# Altium schematic sheet LCD-24.SchDoc: LCD 2.4"
size A4; Date: Not used; ApprovedBy: Not used; CheckedBy: Not used; Author: Not used; CompanyName: STMicroelectronics; DrawnBy: Not used; Engineer: Not used; Organization: Not used; Address1: Not used; Address2: Not used; Address3: Not used; Address4: Not used; Revision: Not used; SheetNumber: 6; SheetTotal: 8; CurrentTime: Not used; CurrentDate: Not used; Time: Not used; DocumentFullPathAndName: Not used; DocumentName: Not used; ModifiedDate: Not used; ImagePath: Not used; ProjectName: Not used; Application_BuildNumber: Not used
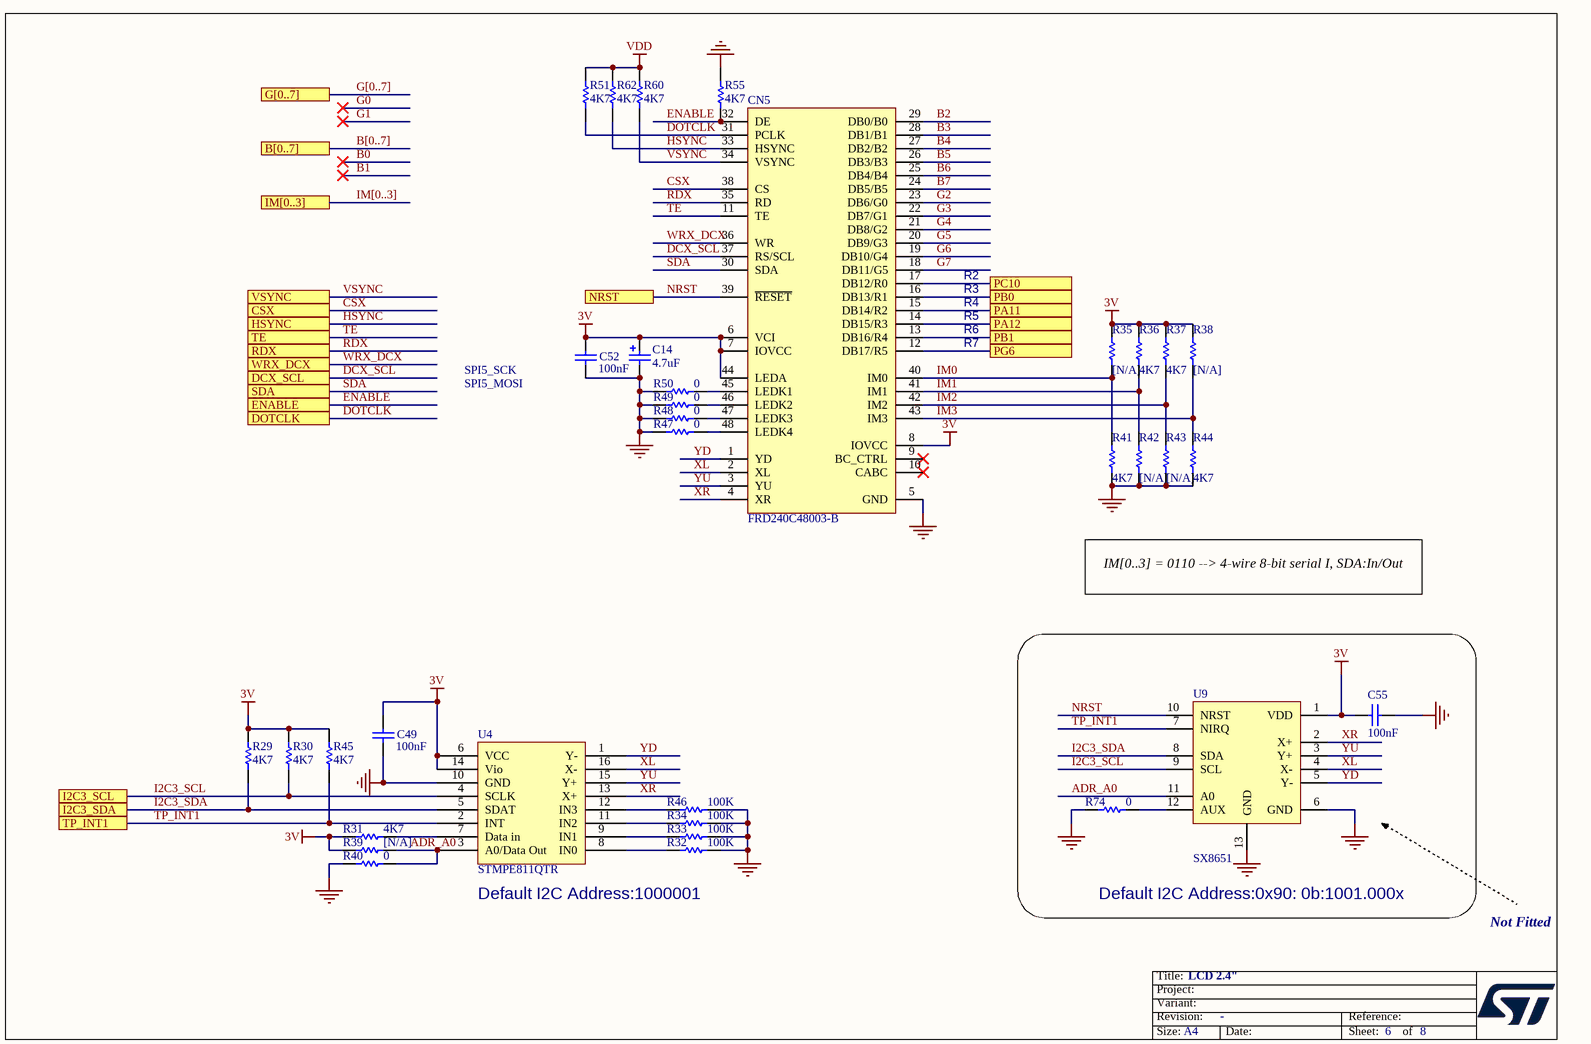
[diagram p0: LCD-24.SchDoc]

## Parts
C14  4.7uF  [TAN-A]
C49  100nF  [0402C]
C52  100nF  [0402C]
C55  100nF  [0402C]
CN5  FRD240C48003-B  [LCD_FRIDA_FRD240C48003-B]
R29  4K7  [0402R]
R30  4K7  [0402R]
R31  4K7  [0402R]
R32  100K  [0402R]
R33  100K  [0402R]
R34  100K  [0402R]
R35  [N/A]  [0402R]
R36  4K7  [0402R]
R37  4K7  [0402R]
R38  [N/A]  [0402R]
R39  [N/A]  [0402R]
R40  0  [0402R]
R41  4K7  [0402R]
R42  [N/A]  [0402R]
R43  [N/A]  [0402R]
R44  4K7  [0402R]
R45  4K7  [0402R]
R46  100K  [0402R]
R47  0  [0603R]
R48  0  [0603R]
R49  0  [0603R]
R50  0  [0603R]
R51  4K7  [0402R]
R55  4K7  [0402R]
R60  4K7  [0402R]
R62  4K7  [0402R]
R74  0  [0402R]
U4  STMPE811QTR  [QFN16_3X3]
U9  SX8651  [ICC_DFN12-EPAD_3X3_P045]

## Blocks framed on the sheet
Default I2C Address:0x90: 0b:1001.000x: C55 R74 U9

## Ports
B[0..7], CSX, DCX_SCL, DOTCLK, ENABLE, G[0..7], HSYNC, I2C3_SCL, I2C3_SDA, IM[0..3], NRST, PA11, PA12, PB0, PB1, PC10, PG6, RDX, SDA, TE, TP_INT1, VSYNC, WRX_DCX

## Nets
3V: C14.1 C49.2 C52.2 C55.1 CN5.6(VCI) CN5.7(IOVCC) CN5.8(IOVCC) CN5.44(LEDA) R29.2 R30.2 R31.1 R35.2 R36.2 R37.2 R38.2 R39.1 R45.2 U4.6(VCC) U4.14(Vio) U9.1(VDD)
GND: C14.2 C49.1 C52.1 C55.2 CN5.5(GND) R32.2 R33.2 R34.2 R40.1 R41.1 R42.1 R43.1 R44.1 R46.2 R47.1 R48.1 R49.1 R50.1 R55.2 R74.1 U4.10(GND) U9.6(GND) U9.13(GND)
VDD: R51.2 R60.2 R62.2
ADR_A0: R39.2 R40.2 U4.3(A0/Data_Out) U9.11(A0)
B2: CN5.29(DB0/B0)
B3: CN5.28(DB1/B1)
B4: CN5.27(DB2/B2)
B5: CN5.26(DB3/B3)
B6: CN5.25(DB4/B4)
B7: CN5.24(DB5/B5)
CSX: CN5.38(CS) ; port CSX
DCX_SCL: CN5.37(RS/SCL) ; port DCX_SCL
DOTCLK: CN5.31(PCLK) R51.1 ; port DOTCLK
ENABLE: CN5.32(DE) R55.1 ; port ENABLE
G2: CN5.23(DB6/G0)
G3: CN5.22(DB7/G1)
G4: CN5.21(DB8/G2)
G5: CN5.20(DB9/G3)
G6: CN5.19(DB10/G4)
G7: CN5.18(DB11/G5)
HSYNC: CN5.33(HSYNC) R62.1 ; port HSYNC
I2C3_SCL: R30.1 U4.4(SCLK) U9.9(SCL) ; port I2C3_SCL
I2C3_SDA: R29.1 U4.5(SDAT) U9.8(SDA) ; port I2C3_SDA
IM0: CN5.40(IM0) R35.1 R41.2
IM1: CN5.41(IM1) R36.1 R42.2
IM2: CN5.42(IM2) R37.1 R43.2
IM3: CN5.43(IM3) R38.1 R44.2
NRST: CN5.39(~{RESET}) U9.10(NRST) ; port NRST
PA11: CN5.15(DB14/R2) ; port PA11
PA12: CN5.14(DB15/R3) ; port PA12
PB0: CN5.16(DB13/R1) ; port PB0
PB1: CN5.13(DB16/R4) ; port PB1
PC10: CN5.17(DB12/R0) ; port PC10
PG6: CN5.12(DB17/R5) ; port PG6
RDX: CN5.35(RD) ; port RDX
SDA: CN5.30(SDA) ; port SDA
TE: CN5.11(TE) ; port TE
TP_INT1: R45.1 U4.2(INT) U9.7(NIRQ) ; port TP_INT1
VSYNC: CN5.34(VSYNC) R60.1 ; port VSYNC
WRX_DCX: CN5.36(WR) ; port WRX_DCX
XL: CN5.2(XL) U4.16(X-) U9.4(X-)
XR: CN5.4(XR) U4.13(X+) U9.2(X+)
YD: CN5.1(YD) U4.1(Y-) U9.5(Y-)
YU: CN5.3(YU) U4.15(Y+) U9.3(Y+)
NetCN5_45: CN5.45(LEDK1) R50.2
NetCN5_46: CN5.46(LEDK2) R49.2
NetCN5_47: CN5.47(LEDK3) R48.2
NetCN5_48: CN5.48(LEDK4) R47.2
NetR31_2: R31.2 U4.7(Data_in)
NetR32_1: R32.1 U4.8(IN0)
NetR33_1: R33.1 U4.9(IN1)
NetR34_1: R34.1 U4.11(IN2)
NetR46_1: R46.1 U4.12(IN3)
NetR74_2: R74.2 U9.12(AUX)

Not connected (* = marked no-connect by the designer): CN5 9(BC_CTRL)* 10(CABC)*

## Buses and harness runs
bus B[0..7] = port B[0..7]
bus G[0..7] = port G[0..7]
bus IM[0..3] = port IM[0..3]

## Notes on the sheet
- R4
- R5
- R3
- R2
- SPI5_MOSI
- SPI5_SCK
- R6
- R7
- IM[0..3] = 0110 --> 4-wire 8-bit serial I, SDA:In/Out
- Default I2C Address:1000001
- Not Fitted
- Title:
- Project:
- Size:
- Revision:
- Variant:
- A4
- -
- Date:
- Reference:
- Sheet:
- of

## Library data of the parts
C14 = Cap Pol1: Polarized Capacitor (Radial); Value: 100pF; Published: 8-Jun-2000; Revision: July-2002: Re-released for DXP Platform.; Publisher: Altium Limited
C49 C52 = Capacitor_ST: Capacitor 0402 / 0603 / 0805; Revision: July-2002: Re-released for DXP Platform.; Value: 100nF
C55 = Capacitor_ST: Capacitor 0402 / 0603 / 0805; Fitted: NO; Revision: July-2002: Re-released for DXP Platform.; Value: 100nF
CN5 = MCD-02110: TFT LCD 2.4inch 240RGB x 320 pixels + RTP; Part_Type: Display; Manufacturer: FRIDA SHENZEN LCD CO.LTD; ECCN_US: EAR99; ECCN_EU: NEC; Internal_Part_Number: MCD-02110; Value: FRD240C48003-B; Status: Checked; Manufacturer_Part_Number: FRD240C48003-B; Alternate_Manufacturer_Part_Number: N/A; Alternate_Manufacturer: N/A; Package: N/A; ComponentLink1Description: Datasheet; ComponentLink1URL: http://tunmcdsvn.tun.st.com/Component_Datasheet_Library/Trunk/Display/FRIDA_LCD_FRD240C48003-B/FRIDA_LCD_FRD240C48003-B.pdf; Order_Code_Digikey: N/A; Order_Code_Farnell: N/A; Order_Code_RS: N/A; Provided_By: n/a; BMS_Part_Number: N/A
R29-R34 R36 R37 R40 R41 R44-R51 R55 R60 R62 = Resistor_ST: Resistor 0402 / 0603 / 0805; Value: 10K
R35 R38 R39 R42 R43 R74 = Resistor_ST: Resistor 0402 / 0603 / 0805; Value: 10K; Fitted: NO
U4 = STMPE811: S-Touch® advanced resistive touchscreen controller, with 8-bit GPIO expander; Manuf_1: STM; Provided: ST; Ref St: xxxxxxxx; ECCN_US/EU: EAR99/NEC; Distrib: ST; Manuf_Part_1: STMPE811QTR; Order: STMPE811QTR
U9 = MCD-01952: Multitouch 4-wire Resistive Touchscreen Controller with 15kV ESD Protection; Part_Type: IC; Manufacturer_Part_Number: SX8651IWLTRT; Manufacturer: SEMTECH; ECCN_US: EAR99; ECCN_EU: NEC; Provided_By: SUBCO; Fitted: NO; Internal_Part_Number: MCD-01952; Value: SX8651; Status: Checked; Package: DFN 3x3; ComponentLink1Description: Datasheet; ComponentLink1URL: http://tunmcdsvn.tun.st.com/Component_Datasheet_Library/Trunk/IC/SEMTECH_TOUCH_CONTROLEUR_SX8651